# Altium schematic sheet Sheet1.SchDoc
size A4; SheetNumber: 1; SheetTotal: 1
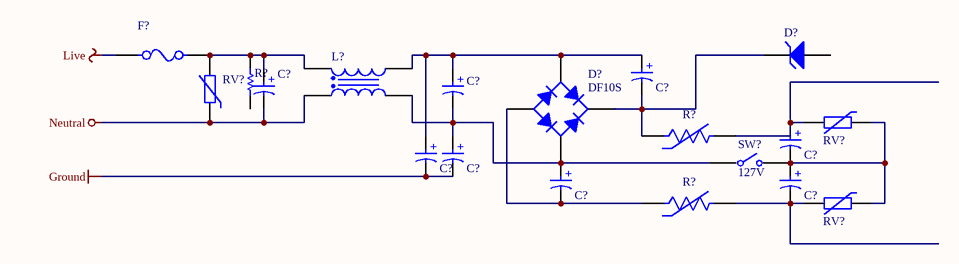
[diagram p0: Sheet1.SchDoc]

## Parts
(Parts that share a designator on the sheet are numbered #1, #2 ... from top to bottom, then left to right.)
C?#1  865060657012  [WCAP-ASLL_D10H10.5]  (value not drawn)
C?#2  865060657012  [WCAP-ASLL_D10H10.5]  (value not drawn)
C?#3  865060657012  [WCAP-ASLL_D10H10.5]  (value not drawn)
C?#4  865060657012  [WCAP-ASLL_D10H10.5]  (value not drawn)
C?#5  865060657012  [WCAP-ASLL_D10H10.5]  (value not drawn)
C?#6  865060657012  [WCAP-ASLL_D10H10.5]  (value not drawn)
C?#7  865060657012  [WCAP-ASLL_D10H10.5]  (value not drawn)
C?#8  865060657012  [WCAP-ASLL_D10H10.5]  (value not drawn)
D?#1  P6SMB6.8AT3G  [ONSC-SMB-2-403A-03_J_V]  (value not drawn)
D?#2  DF10S  [FAIR-SDIP-4_V]
F?  0031.8231  [FP-0031_8231-MFG]  (value not drawn)
L?  744825320  [WE-CMB_Type XL_L30W21H35]  (value not drawn)
R?#1  RC0402FR-07120KL  [RESC1005X40X25LL05T10]  (value not drawn)
R?#2  NCP15XH103J03RC  [FP-NCP15-NCU15-0_05-IPC_A]  (value not drawn)
R?#3  NCP15XH103J03RC  [FP-NCP15-NCU15-0_05-IPC_A]  (value not drawn)
RV?#1  820423211  [D23W7.7H27P1.5]  (value not drawn)
RV?#2  820423211  [D23W7.7H27P1.5]  (value not drawn)
RV?#3  820423211  [D23W7.7H27P1.5]  (value not drawn)
SW?  127V  [FP-B3U-1000P-MFG]

## Nets
Ground: C?#5.2(N) C?#6.2(N)
Live: F?.1
Neutral: C?#2.2(N) L?.2 RV?#1.1
NetC?#1_1: C?#1.1(P) C?#3.1(P) C?#5.1(P) D?#2.3(C) L?.4
NetC?#1_2: C?#1.2(N) D?#1.1(K) D?#2.1(K) R?#2.1
NetC?#2_1: C?#2.1(P) F?.2 L?.1 R?#1.2 RV?#1.2
NetC?#3_2: C?#3.2(N) C?#6.1(P) C?#7.1(P) D?#2.4(C) L?.3 SW?.1
NetC?#4_1: C?#4.1(P) R?#2.2 RV?#2.2
NetC?#4_2: C?#4.2(N) C?#8.1(P) RV?#2.1 RV?#3.1 SW?.2
NetC?#7_2: C?#7.2(N) D?#2.2(A) R?#3.1
NetC?#8_2: C?#8.2(N) R?#3.2 RV?#3.2

Not connected (* = marked no-connect by the designer): D?#1 2(A); R?#1 1

## Notes on the sheet
- (in symbol CMP-03913-54202490-1) +

## Library data of the parts
C?#1-C?#8 = CMP-03913-54202490-1: 865060657012 WCAP-ASLL Aluminum Electrolytic Capacitors; Ripple Current (AC): 600mA; Leakage Current: 110µA; Impedance: 230mΩ; Voltage Rating: 50V; Life (Hours): 5000hours; Polarity: Polar; ESR (Equivalent Series Resistance): 163.242mΩ; Tolerance: 20%; Capacitance: 220µF; Insulation Resistance: 454.545kΩ; REACH SVHC: Unknown; Ripple Current: 600mA; Min Operating Temperature: -55°C; RoHS: Compliant; Voltage Rating (DC): 50V; Height: 10.5mm; Height - Seated (Max): 10.4902mm; NexarPartId: 54202490; Length: 10.5mm; Case/Package: Radial; Max Operating Temperature: 105°C; Diameter: 10mm; Packaging: Tape & Reel (TR); Mount: Surface Mount
D?#1 = CMP-1061-00416-1: 600 W Peak Power Zener Transient Voltage Suppressor, Unidirectional, 2-Pin SMB, Pb-Free, Tape and Reel; Manufacturer: On Semiconductor; V(BR) Typ (V): 6.8; IR Max (uA): 1000; PPK Max (W): 600; Direction: Unidirectional; DatasheetVersion: Rev. J; ComponentLink1Description: Manufacturer URL; ComponentLink3Description: Package Specification; ComponentLink2URL: http://www.onsemi.com/pub_link/Collateral/P6SMB6.8AT3-D.PDF; PartNumber: P6SMB6.8AT3G; ComponentLink1URL: http://www.onsemi.com/; ComponentLink2Description: Datasheet; ComponentLink3URL: http://www.onsemi.com/pub_link/Collateral/P6SMB6.8AT3-D.PDF; Mounting Technology: Surface Mount; RoHS: Pb-Free; PackageDescription: 2-Pin Small Molded Package, J-Bend Lead, Body 4.33 x 3.625 mm; Packing: Tape and Reel; PackageReference: SMB-2-403A-03_J; PackageVersion: Rev. J, 07/2012
D?#2 = CMP-2000-06153-1: Bridge Rectifier, 1.5 A, 1000 V, 4-Pin SDIP, RoHS, Tape and Reel; Manufacturer: FairchildSemiconductor; Configuration: Single; Peak Average Forward Current: 1.5@Ta=40CA; Peak Reverse Repetitive Voltage: 1000V; Peak Reverse Current: 5uA; Bridge Type: SinglePhase; Peak Forward Voltage: 1.1@1AV; Datasheet Version: Rev. 1.5, 05/2015; Package: 4SDIPSMD; Operating Temperature: -55to150°C; Package Reference: SDIP 4L; Datasheet URL: http://www.farnell.com/datasheets/1941063.pdf; Packaging: Tape&Reel; Manufacturer URL: https://www.fairchildsemi.com/; Mounting Technology: SurfaceMount; Category: BridgeRectifier; Package Description: 4-Pin Surface Mount Device, Body 8.28 x 6.35 mm, Pitch 5.1 mm; Mounting: SurfaceMount
F? = CMP-26292-000005-1: FUSE BLOK CARTRIDGE 600V 16A PCB; Manufacturer: Schurter; Voltage Rating Ac: 500V; Number Of Fuses: 1; Standoff Height: 0.7mm; Conn Orientation: Horizontal; ComponentLink2URL: https://www.schurter.com/en/datasheet/typ_OGD.pdf; Voltage Rating Dc: 600V; Package: 0; Device Class L3: unset; Digikey Description: FUSE BLOK CARTRIDGE 600V 16A PCB; Mouser Description: Fuse Holder OGD FUSEHOLDER 5X20/6.3X32; Category: Fuse; Device Class L2: Fuse Holders; Height: 12.7mm; ComponentLink2Description: Datasheet; Ambient Temperature Range Low: -40°C; Ambient Temperature Range High: +85°C; Octopart: https://octopart.com/0031.8231-schurter-8659; Automotive: No; RoHS: TRUE; Fuse Current: 16A; Lead Free: Yes; Device Class L1: Circuit Protection; Manufacturer Part Number: 0031.8231
L? = CMP-0223-00081-2: NexarPartId: 22803428; Resistance: 160mΩ; Voltage Rating: 250V; Current Rating: 3A; Pin Length: 5mm; Inductance Tolerance: 30%; Inductance: 20mH; Ambient Temperature Range High: 70°C; Length: 30mm; Number of Pins: 4; Max Operating Temperature: 125°C; Min Operating Temperature: -40°C; Width: 21mm; Packaging: Bulk; RoHS: Compliant; Height: 35mm; Ambient Temperature Range Low: -40°C
R?#1 = CMP-2002-07007-1: Manufacturer: Yageo / Phycomp; Part Number: RC0402FR-07120KL
R?#2 R?#3 = CMP-06022-000233-2: NTC Thermistor for Temperature Sensor, 0402, 10kΩ, 5%, 0.1mA, 5V; Current Rating: 310uA; Resistance: 10kR; Max Power Dissipation: 100mW; Accuracy: 0.7%; Depth: 0.5mm; Termination: SMD/SMT; Resistance Tolerance: 5%; REACH SVHC: No SVHC; Lead Free: Lead Free; Radiation Hardening: No; Max Operating Temperature: 125°C; Tolerance: 5%; Package Quantity: 1; Series: NCP; RoHS Compliant: Yes; Width: 0.5mm; Packaging: Tape and Reel; Case Code (Metric): 1005; Number of Pins: 2; Height: 0.5mm; Min Operating Temperature: -40°C; Mount: Surface Mount; Case Code (Imperial): 0402; Length: 1mm; Power Rating: 100mW; Case/Package: 0402
RV?#1-RV?#3 = CMP-03913-22865218-1: 820423211 WE-VD Series Metal Oxide Varistor 760pF 100A, Clamping 842V, Varistor 510V; Max Surge Current: 10kA; Tolerance: 10%; Voltage Rating (AC): 320V; Voltage Rating (DC): 418V; Energy: 382J; Mount: Radial; Max Operating Temperature: 85°C; Min Operating Temperature: -40°C; Width: 5.3mm; RoHS: Compliant; Length: 23mm; NexarPartId: 22865218; Clamping Current: 100A; Termination: Radial; REACH SVHC: Unknown; Lead Pitch: 10mm; Capacitance: 760pF; Varistor Voltage: 510V; Height: 25mm; Clamping Voltage: 842V; Diameter: 23mm; Max Voltage Rating (DC): 418V; Max Voltage Rating (AC): 320V
SW? = CMP-2100-03586-2: SWITCH TACTILE SPST-NO 0.05A 12V; Contact Resistance: 100mR; Operating Force: 1.5N; Max Current Rating: 50mA; Switch Travel: 0.15mm; Actuator Type: Standard; Mechanical Life: 200000Cycles; Ratings: Dust Proof; Illumination Type: Non-Illuminated; Throw Configuration: SPST; Actuator Length: 0.4mm; Switch Function: Off-Mom; Height: 1.2mm; Width: 3mm; Weight: 0.000776oz; Contact Material: Silver; Max Voltage Rating (DC): 12V; Insulation Resistance: 100MR; Lead Free: Lead Free; Current Rating: 50mA; Termination: SMD/SMT; Length: 4mm; Voltage Rating (DC): 12V; Contact Current Rating: 50mA; Orientation: Straight; Depth: 2.5mm; Max Operating Temperature: 70°C; Packaging: Tape and Reel; Min Operating Temperature: -25°C; Package Quantity: 1; Mount: Surface Mount; Electrical Life: 200000Cycles